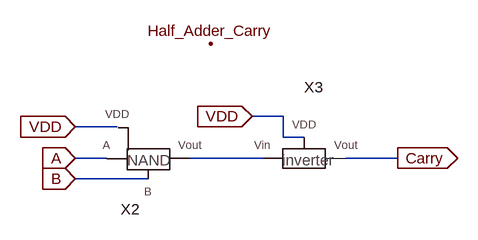
[diagram p0: schematic Half_Adder_Carry.asc]
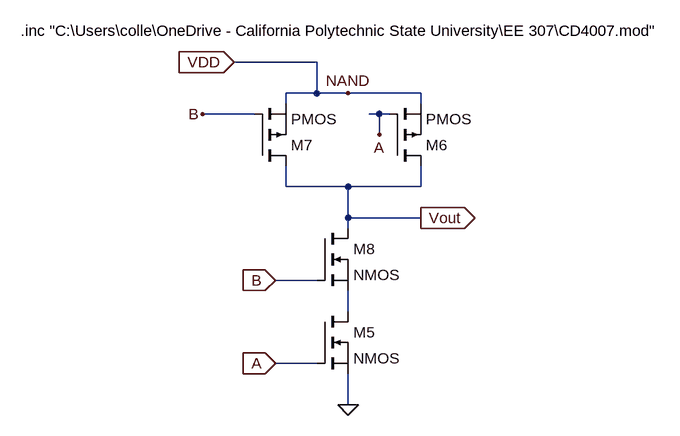
[diagram p1: sub-circuit nand_gate.asc]
Half_Adder_Carry.asc, the LTspice schematic file:
Version 4
SHEET 1 880 680
WIRE 384 272 336 272
WIRE 128 288 64 288
WIRE 384 304 384 272
WIRE 416 304 384 304
WIRE 112 336 64 336
WIRE 352 336 240 336
WIRE 560 336 480 336
WIRE 176 368 64 368
FLAG 272 160 Half_Adder_Carry
FLAG 64 288 VDD
IOPIN 64 288 In
FLAG 64 336 A
IOPIN 64 336 In
FLAG 64 368 B
IOPIN 64 368 In
FLAG 336 272 VDD
IOPIN 336 272 In
FLAG 560 336 Carry
IOPIN 560 336 Out
SYMBOL Nand_gate 224 352 R0
SYMATTR InstName X2
SYMBOL Inverter 448 352 R0
SYMATTR InstName X3

nand_gate.asc, the sub-circuit schematic file:
Version 4
SHEET 1 880 680
WIRE -224 -192 -352 -192
WIRE -224 -144 -224 -192
WIRE -224 -144 -272 -144
WIRE -176 -144 -224 -144
WIRE -64 -144 -176 -144
WIRE -272 -128 -272 -144
WIRE -64 -128 -64 -144
WIRE -320 -112 -400 -112
WIRE -128 -112 -144 -112
WIRE -112 -112 -128 -112
WIRE -128 -80 -128 -112
WIRE -272 0 -272 -32
WIRE -176 0 -272 0
WIRE -64 0 -64 -32
WIRE -64 0 -176 0
WIRE -176 48 -176 0
WIRE -64 48 -176 48
WIRE -176 64 -176 48
WIRE -224 144 -288 144
WIRE -176 192 -176 160
WIRE -224 272 -288 272
WIRE -176 336 -176 288
FLAG -176 -144 NAND
FLAG -176 336 0
FLAG -288 272 A
IOPIN -288 272 In
FLAG -128 -80 A
FLAG -400 -112 B
FLAG -288 144 B
IOPIN -288 144 In
FLAG -64 48 Vout
IOPIN -64 48 Out
FLAG -352 -192 VDD
IOPIN -352 -192 In
SYMBOL nmos -224 192 R0
SYMATTR InstName M5
SYMBOL pmos -112 -32 M180
SYMATTR InstName M6
SYMBOL pmos -320 -32 M180
SYMATTR InstName M7
SYMBOL nmos -224 64 R0
SYMATTR InstName M8
TEXT -680 -240 Left 2 !.inc "C:\\Users\\colle\\OneDrive - California Polytechnic State University\\EE 307\\CD4007.mod"

The netlist it stands for:
* Half_Adder_Carry.asc
XX2 A B N001 VDD nand_gate
XX3 N001 VDD Carry Inverter  ; pins Vin VDD Vout

* block symbol definitions
.subckt nand_gate A B Vout VDD
M5 N001 A 0 0 NMOS
M6 Vout A VDD VDD PMOS
M7 Vout B VDD VDD PMOS
M8 Vout B N001 N001 NMOS
.inc "C:\Users\colle\OneDrive - California Polytechnic State University\EE 307\CD4007.mod"
.ends nand_gate

.model NMOS NMOS
.model PMOS PMOS
.lib standard.mos
.backanno
.end